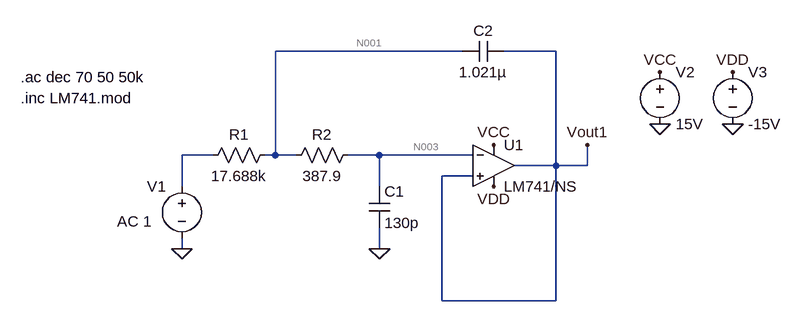
[diagram p0: schematic Sallen_Key_Stages.asc]
Sallen_Key_Stages.asc, the LTspice schematic file:
Version 4
SHEET 1 2164 680
WIRE 400 -64 112 -64
WIRE 544 -64 464 -64
WIRE 16 96 -32 96
WIRE 112 96 112 -64
WIRE 112 96 96 96
WIRE 144 96 112 96
WIRE 272 96 224 96
WIRE 416 96 272 96
WIRE 544 112 544 -64
WIRE 544 112 480 112
WIRE 592 112 592 80
WIRE 592 112 544 112
WIRE 416 128 368 128
WIRE -32 144 -32 96
WIRE 272 144 272 96
WIRE -32 240 -32 224
WIRE 272 240 272 208
WIRE 368 320 368 128
WIRE 544 320 544 112
WIRE 544 320 368 320
FLAG -32 240 0
FLAG 272 240 0
FLAG 448 80 VCC
FLAG 448 144 VDD
FLAG 704 -32 VCC
FLAG 816 -32 VDD
FLAG 704 48 0
FLAG 816 48 0
FLAG 592 80 Vout1
SYMBOL res 112 80 R90
WINDOW 0 0 56 VBottom 2
WINDOW 3 32 56 VTop 2
SYMATTR InstName R1
SYMATTR Value 17.688k
SYMBOL res 240 80 R90
WINDOW 0 0 56 VBottom 2
WINDOW 3 32 56 VTop 2
SYMATTR InstName R2
SYMATTR Value 387.9
SYMBOL cap 256 144 R0
SYMATTR InstName C1
SYMATTR Value 130p
SYMBOL cap 464 -80 R90
WINDOW 0 0 32 VBottom 2
WINDOW 3 32 32 VTop 2
SYMATTR InstName C2
SYMATTR Value 1.021µ
SYMBOL voltage -32 128 M0
WINDOW 3 50 68 Left 2
WINDOW 123 46 70 Left 2
WINDOW 39 0 0 Left 0
SYMATTR Value ""
SYMATTR Value2 AC 1
SYMATTR InstName V1
SYMBOL Opamps\\opamp2 448 48 R0
SYMATTR InstName U1
SYMATTR Value LM741/NS
SYMBOL voltage 704 -48 R0
WINDOW 123 0 0 Left 0
WINDOW 39 0 0 Left 0
SYMATTR InstName V2
SYMATTR Value 15V
SYMBOL voltage 816 -48 R0
WINDOW 123 0 0 Left 0
WINDOW 39 0 0 Left 0
SYMATTR InstName V3
SYMATTR Value -15V
TEXT -280 -24 Left 2 !.ac dec 70 50 50k
TEXT -280 8 Left 2 !.inc LM741.mod

The netlist it stands for:
* Sallen_Key_Stages.asc
R1 N001 N002 17.688k
R2 N003 N001 387.9
C1 N003 0 130p
C2 Vout1 N001 1.021µ
V1 N002 0 AC 1
XU1 Vout1 N003 VCC VDD Vout1 LM741/NS  ; pins In+ In- V+ V- OUT
V2 VCC 0 15V
V3 VDD 0 -15V
.ac dec 70 50 50k
.inc LM741.mod
.backanno
.end

* Results of the author's LTspice run, read from the files saved beside the schematic
* Operating Point, zero values left out:
*   V(n001) = -1.802 mV
*   V(n003) = -1.841 mV
*   V(vout1) = -2.841 mV
*   V(vdd) = -15 V
*   V(vcc) = 15 V
*   I(R2) = -101.9 nA
*   I(R1) = -101.9 nA
*   I(V3) = 1.701 mA
*   I(V2) = -1.701 mA
*   I(V1) = -101.9 nA
*   Ix(u1:1) = 57.86 nA
*   Ix(u1:2) = 101.9 nA
*   Ix(u1:99) = 1.701 mA
*   Ix(u1:50) = -1.701 mA
*   Ix(u1:28) = -57.86 nA
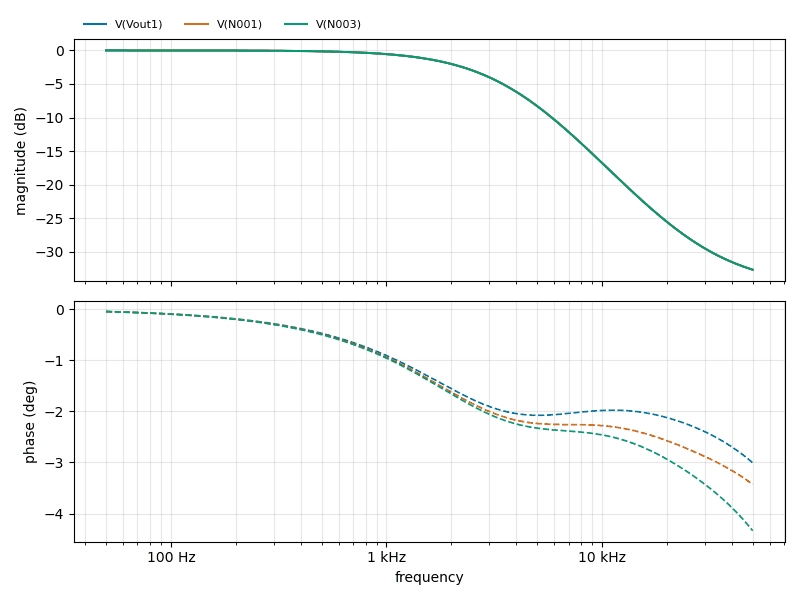
[diagram p1: AC Analysis of Sallen_Key_Stages.asc, plotted from the saved traces]
* AC Analysis, 1 run:
*   V(Vout1): -0.00 dB at 50 Hz, -32.65 dB at 50 kHz, peak -0.00 dB at 50 Hz, 3 dB below the peak at 2.519 kHz
*   V(N001): -0.00 dB at 50 Hz, -32.65 dB at 50 kHz, peak -0.00 dB at 50 Hz, 3 dB below the peak at 2.519 kHz
*   V(N003): -0.00 dB at 50 Hz, -32.65 dB at 50 kHz, peak -0.00 dB at 50 Hz, 3 dB below the peak at 2.519 kHz